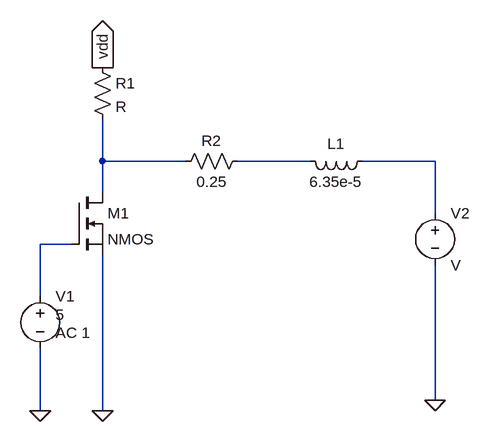
[diagram p0: schematic 1.asc]
1.asc, the LTspice schematic file:
Version 4
SHEET 1 880 680
WIRE 80 16 80 -48
WIRE 208 16 80 16
WIRE 400 16 288 16
WIRE 592 16 480 16
WIRE 80 64 80 16
WIRE 592 96 592 16
WIRE 32 144 -16 144
WIRE -16 224 -16 144
WIRE 592 384 592 176
WIRE -16 400 -16 304
WIRE 80 400 80 160
FLAG -16 400 0
FLAG 80 400 0
FLAG 592 384 0
FLAG 80 -128 vdd
IOPIN 80 -128 Out
SYMBOL voltage -16 208 R0
WINDOW 3 24 44 Left 2
WINDOW 123 24 72 Left 2
WINDOW 39 0 0 Left 2
SYMATTR InstName V1
SYMATTR Value 5
SYMATTR Value2 AC 1
SYMBOL nmos 32 64 R0
SYMATTR InstName M1
SYMBOL res 64 -144 R0
SYMATTR InstName R1
SYMBOL res 304 0 R90
WINDOW 0 0 56 VBottom 2
WINDOW 3 32 56 VTop 2
SYMATTR InstName R2
SYMATTR Value 0.25
SYMBOL ind 496 0 R90
WINDOW 0 5 56 VBottom 2
WINDOW 3 32 56 VTop 2
SYMATTR InstName L1
SYMATTR Value 6.35e-5
SYMBOL voltage 592 80 R0
SYMATTR InstName V2

The netlist it stands for:
* 1.asc
V1 N004 0 5 AC 1
M1 N001 N004 0 0 NMOS
R1 vdd N001 R
R2 N002 N001 0.25
L1 N003 N002 6.35e-5
V2 N003 0 V
.model NMOS NMOS
.model PMOS PMOS
.lib standard.mos
.backanno
.end